# Altium schematic sheet Brick_Diagram.SchDoc
size A4
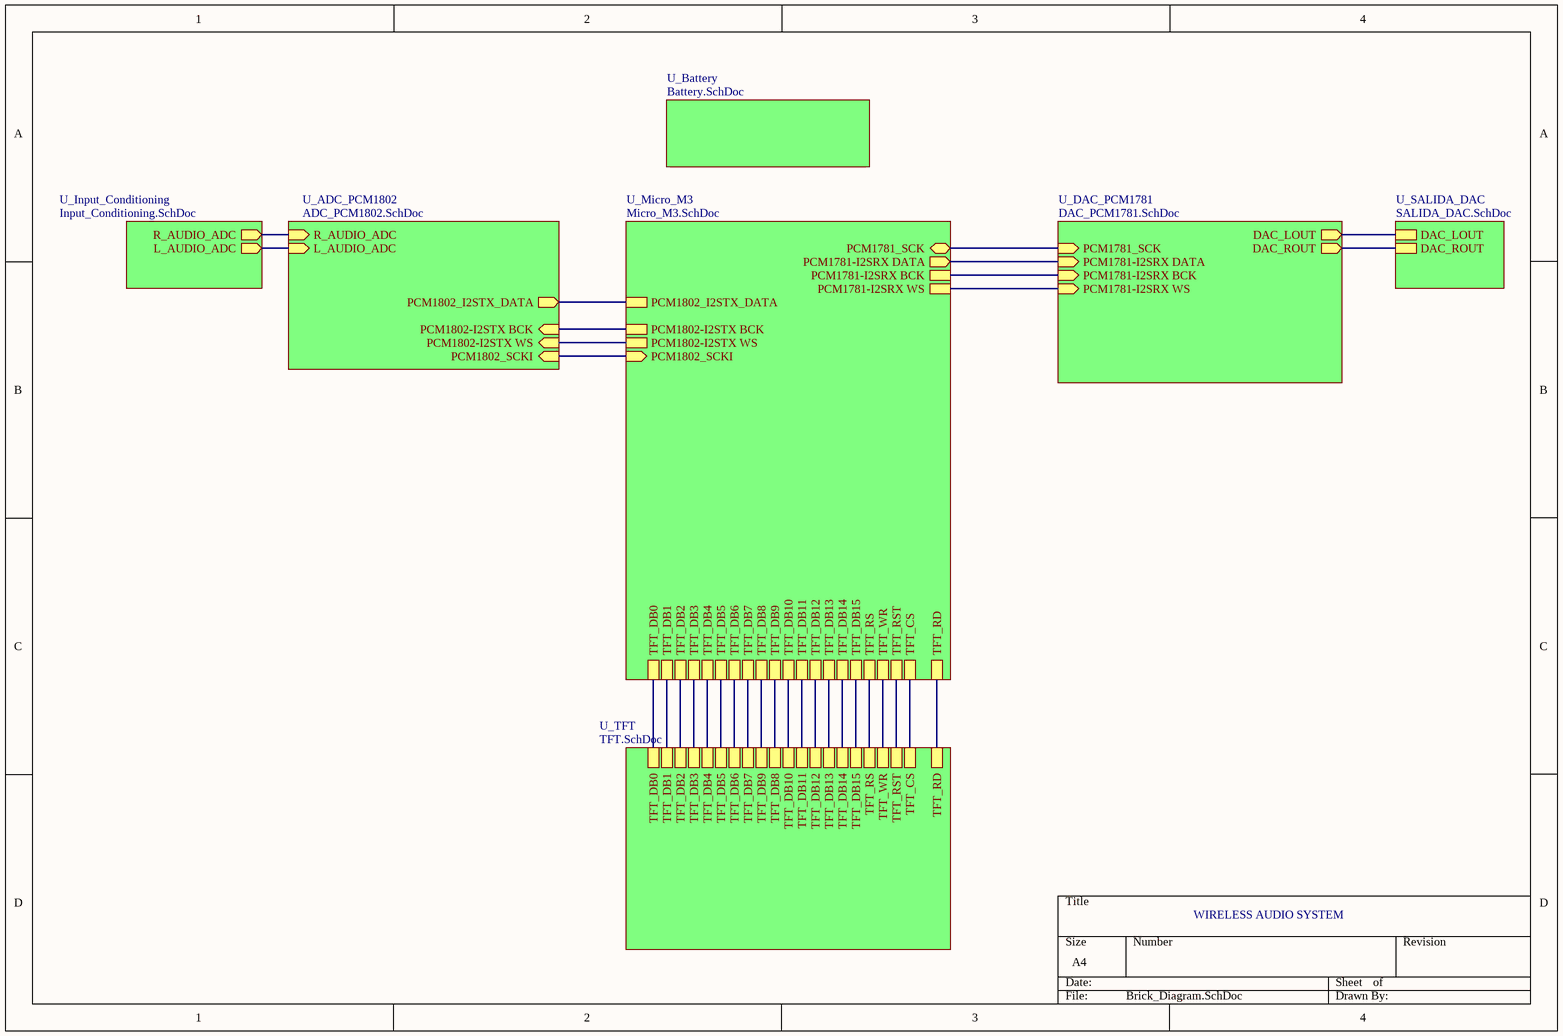
[diagram p0: Brick_Diagram.SchDoc]

## Sub-sheets
U_ADC_PCM1802 = ADC_PCM1802.SchDoc: L_AUDIO_ADC (in), R_AUDIO_ADC (in), PCM1802-I2STX BCK (in), PCM1802_I2STX_DATA (out), PCM1802_SCKI (in), PCM1802-I2STX WS (in)
U_Battery = Battery.SchDoc: no entries
U_DAC_PCM1781 = DAC_PCM1781.SchDoc: PCM1781-I2SRX DATA (in), PCM1781-I2SRX BCK (in), PCM1781_SCK (in), PCM1781-I2SRX WS (in), DAC_LOUT (out), DAC_ROUT (out)
U_Input_Conditioning = Input_Conditioning.SchDoc: R_AUDIO_ADC (out), L_AUDIO_ADC (out)
U_Micro_M3 = Micro_M3.SchDoc: PCM1781_SCK (bidir), PCM1802-I2STX BCK, PCM1802-I2STX WS, PCM1802_I2STX_DATA, PCM1781-I2SRX BCK, PCM1781-I2SRX WS, PCM1781-I2SRX DATA (out), PCM1802_SCKI (in), TFT_DB0, TFT_DB1, TFT_DB2, TFT_DB4, TFT_DB5, TFT_DB3, TFT_DB6, TFT_DB8, TFT_DB9, TFT_DB7, TFT_DB10, TFT_DB11, TFT_DB12, TFT_DB13, TFT_DB14, TFT_DB15, TFT_RS, TFT_WR, TFT_RST, TFT_CS, TFT_RD
U_SALIDA_DAC = SALIDA_DAC.SchDoc: DAC_LOUT, DAC_ROUT
U_TFT = TFT.SchDoc: TFT_CS, TFT_WR, TFT_RST, TFT_DB0, TFT_DB1, TFT_DB2, TFT_DB3, TFT_DB4, TFT_DB5, TFT_DB6, TFT_DB7, TFT_DB9, TFT_DB8, TFT_DB10, TFT_DB11, TFT_DB12, TFT_DB13, TFT_DB14, TFT_DB15, TFT_RS, TFT_RD

## Nets
(unnamed): sheet U_Input_Conditioning/R_AUDIO_ADC, sheet U_ADC_PCM1802/R_AUDIO_ADC
(unnamed): sheet U_Input_Conditioning/L_AUDIO_ADC, sheet U_ADC_PCM1802/L_AUDIO_ADC
(unnamed): sheet U_DAC_PCM1781/PCM1781-I2SRX DATA, sheet U_Micro_M3/PCM1781-I2SRX DATA
(unnamed): sheet U_DAC_PCM1781/PCM1781-I2SRX BCK, sheet U_Micro_M3/PCM1781-I2SRX BCK
(unnamed): sheet U_DAC_PCM1781/PCM1781_SCK, sheet U_Micro_M3/PCM1781_SCK
(unnamed): sheet U_DAC_PCM1781/PCM1781-I2SRX WS, sheet U_Micro_M3/PCM1781-I2SRX WS
(unnamed): sheet U_DAC_PCM1781/DAC_LOUT, sheet U_SALIDA_DAC/DAC_LOUT
(unnamed): sheet U_DAC_PCM1781/DAC_ROUT, sheet U_SALIDA_DAC/DAC_ROUT
(unnamed): sheet U_Micro_M3/PCM1802-I2STX BCK, sheet U_ADC_PCM1802/PCM1802-I2STX BCK
(unnamed): sheet U_Micro_M3/PCM1802-I2STX WS, sheet U_ADC_PCM1802/PCM1802-I2STX WS
(unnamed): sheet U_Micro_M3/PCM1802_I2STX_DATA, sheet U_ADC_PCM1802/PCM1802_I2STX_DATA
(unnamed): sheet U_Micro_M3/PCM1802_SCKI, sheet U_ADC_PCM1802/PCM1802_SCKI
(unnamed): sheet U_Micro_M3/TFT_DB0, sheet U_TFT/TFT_DB0
(unnamed): sheet U_Micro_M3/TFT_DB1, sheet U_TFT/TFT_DB1
(unnamed): sheet U_Micro_M3/TFT_DB2, sheet U_TFT/TFT_DB2
(unnamed): sheet U_Micro_M3/TFT_DB4, sheet U_TFT/TFT_DB4
(unnamed): sheet U_Micro_M3/TFT_DB5, sheet U_TFT/TFT_DB5
(unnamed): sheet U_Micro_M3/TFT_DB3, sheet U_TFT/TFT_DB3
(unnamed): sheet U_Micro_M3/TFT_DB6, sheet U_TFT/TFT_DB6
(unnamed): sheet U_Micro_M3/TFT_DB8, sheet U_TFT/TFT_DB9
(unnamed): sheet U_Micro_M3/TFT_DB9, sheet U_TFT/TFT_DB8
(unnamed): sheet U_Micro_M3/TFT_DB7, sheet U_TFT/TFT_DB7
(unnamed): sheet U_Micro_M3/TFT_DB10, sheet U_TFT/TFT_DB10
(unnamed): sheet U_Micro_M3/TFT_DB11, sheet U_TFT/TFT_DB11
(unnamed): sheet U_Micro_M3/TFT_DB12, sheet U_TFT/TFT_DB12
(unnamed): sheet U_Micro_M3/TFT_DB13, sheet U_TFT/TFT_DB13
(unnamed): sheet U_Micro_M3/TFT_DB14, sheet U_TFT/TFT_DB14
(unnamed): sheet U_Micro_M3/TFT_DB15, sheet U_TFT/TFT_DB15
(unnamed): sheet U_Micro_M3/TFT_RS, sheet U_TFT/TFT_RS
(unnamed): sheet U_Micro_M3/TFT_WR, sheet U_TFT/TFT_WR
(unnamed): sheet U_Micro_M3/TFT_RST, sheet U_TFT/TFT_RST
(unnamed): sheet U_Micro_M3/TFT_CS, sheet U_TFT/TFT_CS
(unnamed): sheet U_Micro_M3/TFT_RD, sheet U_TFT/TFT_RD

## Notes on the sheet
- WIRELESS AUDIO SYSTEM